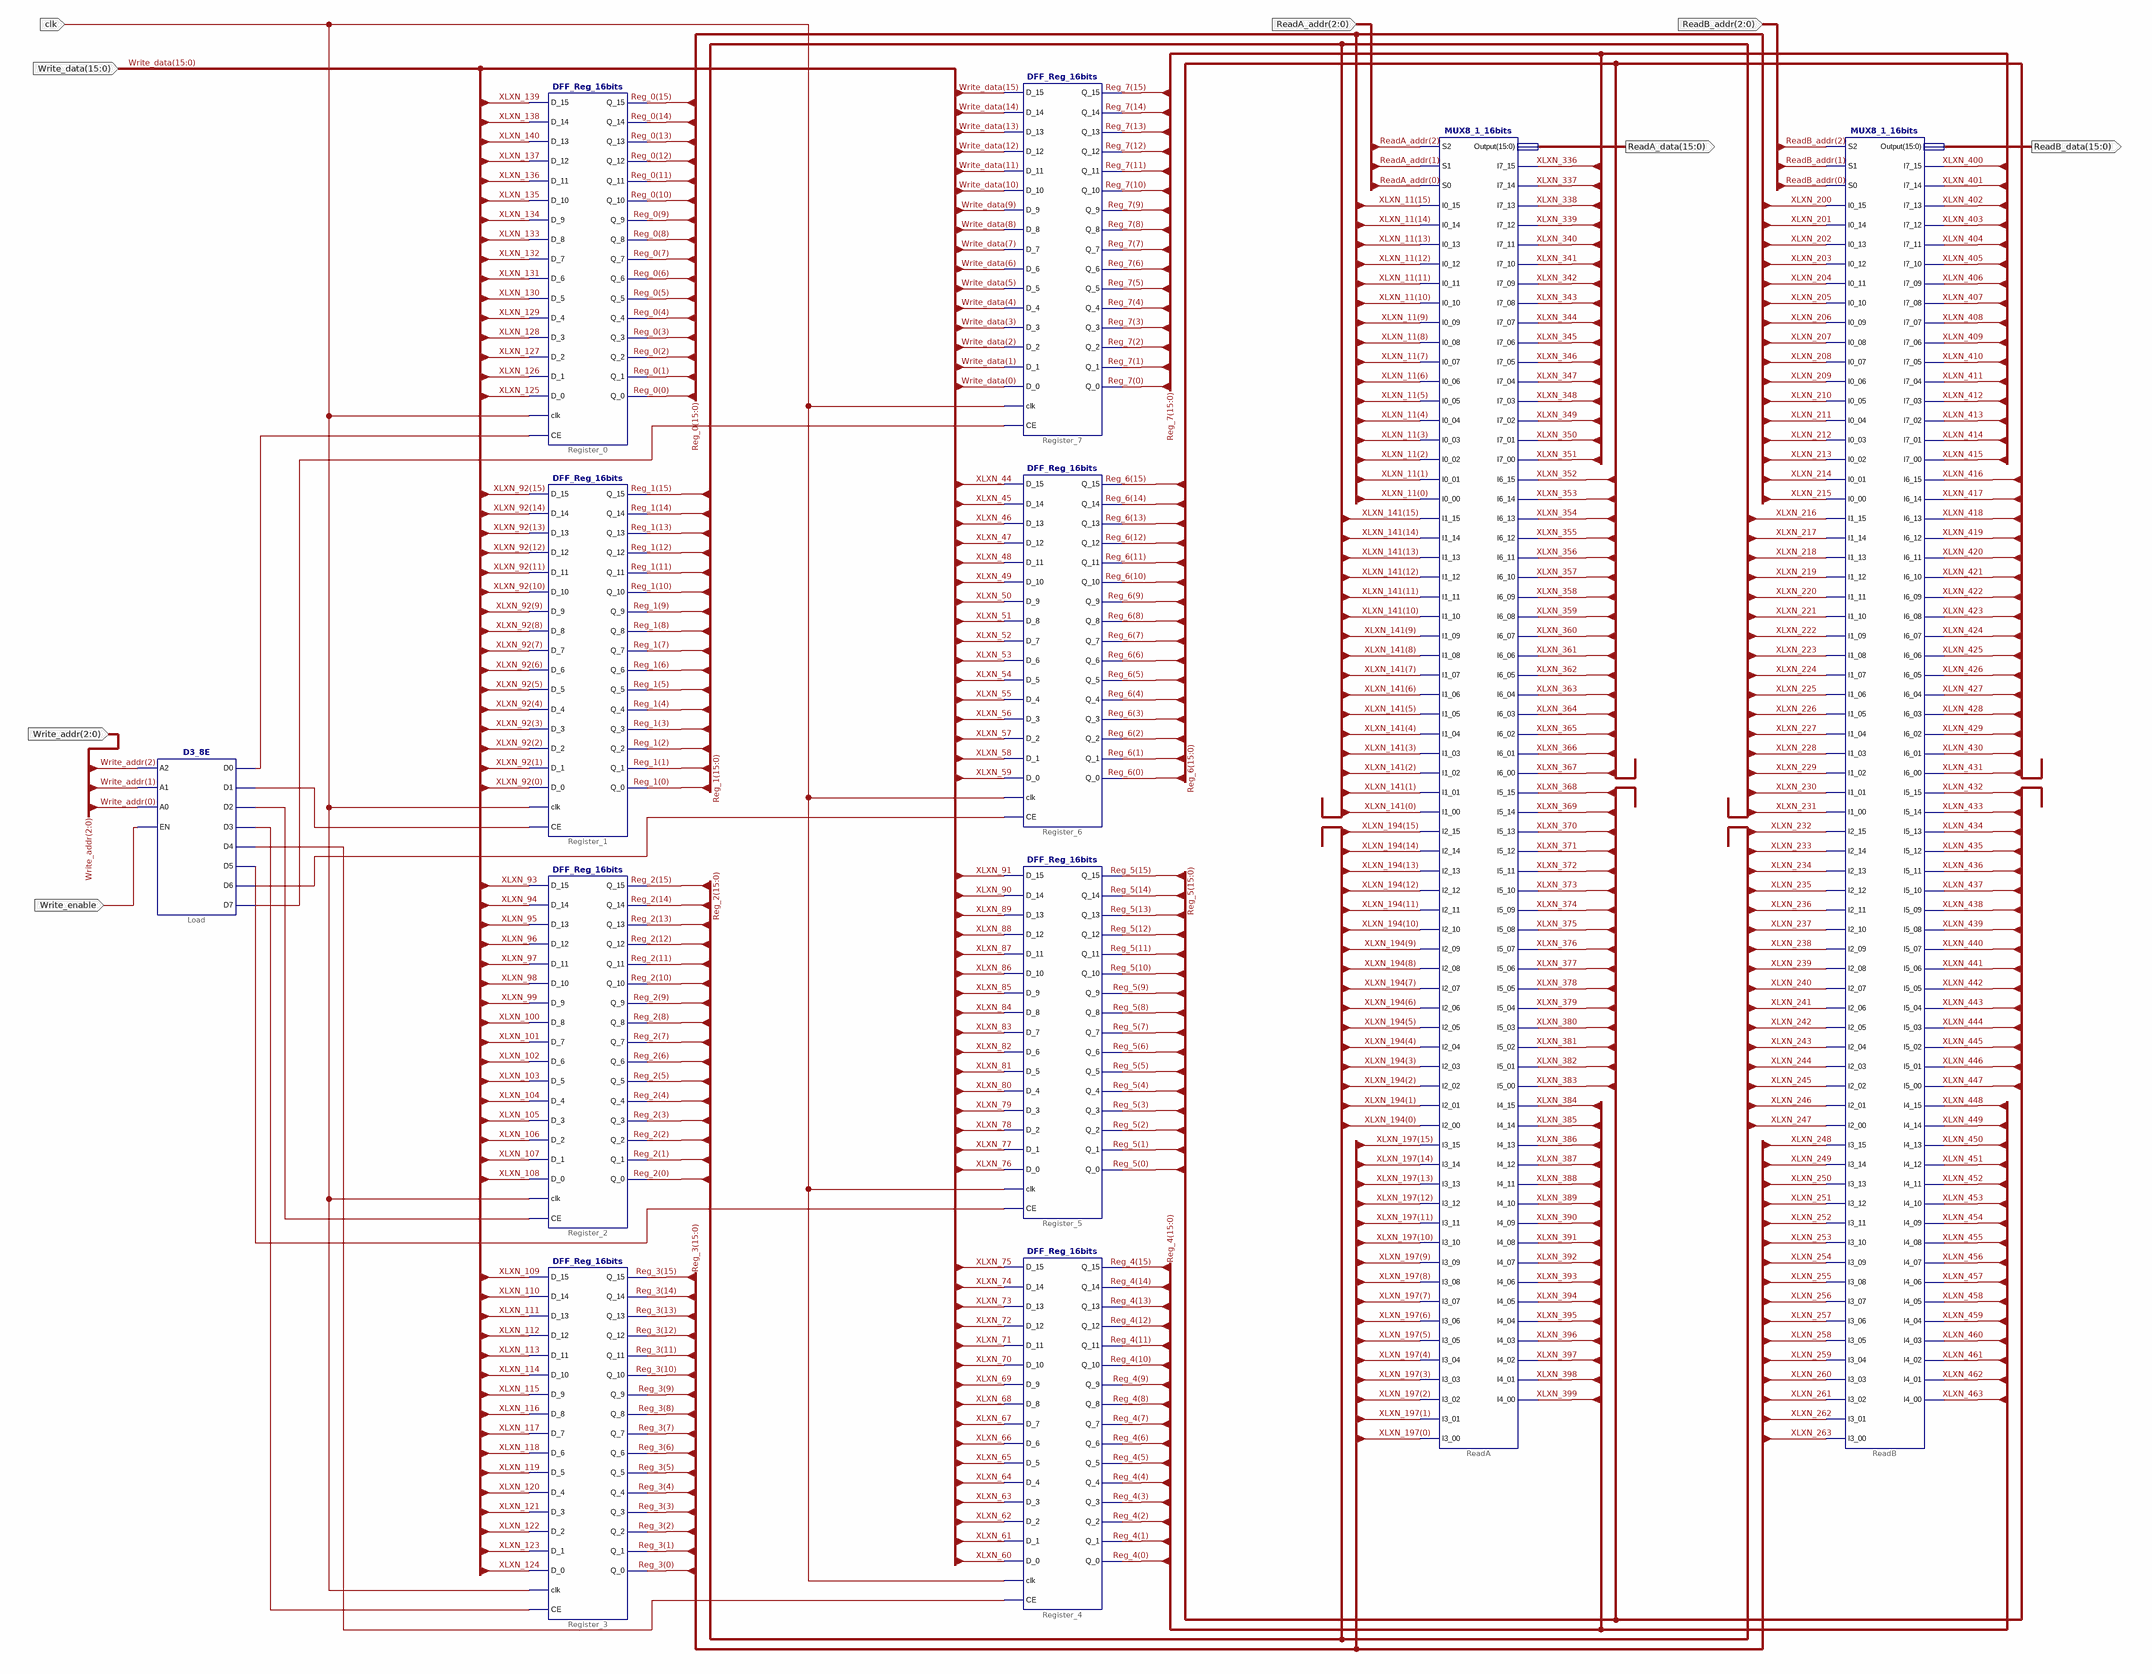
[diagram p0: schematic sheet 1]
// Xilinx ISE schematic Reg_File_16bits.sch (virtex6) as structural Verilog: 11 symbols, 8 ports
module Reg_File_16bits (
  input  [2:0] Write_addr,
  input  Write_enable,
  input  clk,
  input  [15:0] Write_data,
  input  [2:0] ReadA_addr,
  input  [2:0] ReadB_addr,
  output [15:0] ReadA_data,
  output [15:0] ReadB_data
);

  wire XLXN_1, XLXN_2, XLXN_8, XLXN_9, XLXN_44, XLXN_45, XLXN_46, XLXN_47, XLXN_48, XLXN_49, XLXN_50,
       XLXN_51, XLXN_52, XLXN_53, XLXN_54, XLXN_55, XLXN_56, XLXN_57, XLXN_58, XLXN_59, XLXN_60, XLXN_61,
       XLXN_62, XLXN_63, XLXN_64, XLXN_65, XLXN_66, XLXN_67, XLXN_68, XLXN_69, XLXN_70, XLXN_71, XLXN_72,
       XLXN_73, XLXN_74, XLXN_75, XLXN_76, XLXN_77, XLXN_78, XLXN_79, XLXN_80, XLXN_81, XLXN_82, XLXN_83,
       XLXN_84, XLXN_85, XLXN_86, XLXN_87, XLXN_88, XLXN_89, XLXN_90, XLXN_91, XLXN_93, XLXN_94, XLXN_95,
       XLXN_96, XLXN_97, XLXN_98, XLXN_99, XLXN_100, XLXN_101, XLXN_102, XLXN_103, XLXN_104, XLXN_105,
       XLXN_106, XLXN_107, XLXN_108, XLXN_109, XLXN_110, XLXN_111, XLXN_112, XLXN_113, XLXN_114, XLXN_115,
       XLXN_116, XLXN_117, XLXN_118, XLXN_119, XLXN_120, XLXN_121, XLXN_122, XLXN_123, XLXN_124, XLXN_125,
       XLXN_126, XLXN_127, XLXN_128, XLXN_129, XLXN_130, XLXN_131, XLXN_132, XLXN_133, XLXN_134, XLXN_135,
       XLXN_136, XLXN_137, XLXN_138, XLXN_139, XLXN_140, XLXN_200, XLXN_201, XLXN_202, XLXN_203, XLXN_204,
       XLXN_205, XLXN_206, XLXN_207, XLXN_208, XLXN_209, XLXN_210, XLXN_211, XLXN_212, XLXN_213, XLXN_214,
       XLXN_215, XLXN_216, XLXN_217, XLXN_218, XLXN_219, XLXN_220, XLXN_221, XLXN_222, XLXN_223, XLXN_224,
       XLXN_225, XLXN_226, XLXN_227, XLXN_228, XLXN_229, XLXN_230, XLXN_231, XLXN_232, XLXN_233, XLXN_234,
       XLXN_235, XLXN_236, XLXN_237, XLXN_238, XLXN_239, XLXN_240, XLXN_241, XLXN_242, XLXN_243, XLXN_244,
       XLXN_245, XLXN_246, XLXN_247, XLXN_248, XLXN_249, XLXN_250, XLXN_251, XLXN_252, XLXN_253, XLXN_254,
       XLXN_255, XLXN_256, XLXN_257, XLXN_258, XLXN_259, XLXN_260, XLXN_261, XLXN_262, XLXN_263, XLXN_336,
       XLXN_337, XLXN_338, XLXN_339, XLXN_340, XLXN_341, XLXN_342, XLXN_343, XLXN_344, XLXN_345, XLXN_346,
       XLXN_347, XLXN_348, XLXN_349, XLXN_350, XLXN_351, XLXN_352, XLXN_353, XLXN_354, XLXN_355, XLXN_356,
       XLXN_357, XLXN_358, XLXN_359, XLXN_360, XLXN_361, XLXN_362, XLXN_363, XLXN_364, XLXN_365, XLXN_366,
       XLXN_367, XLXN_368, XLXN_369, XLXN_370, XLXN_371, XLXN_372, XLXN_373, XLXN_374, XLXN_375, XLXN_376,
       XLXN_377, XLXN_378, XLXN_379, XLXN_380, XLXN_381, XLXN_382, XLXN_383, XLXN_384, XLXN_385, XLXN_386,
       XLXN_387, XLXN_388, XLXN_389, XLXN_390, XLXN_391, XLXN_392, XLXN_393, XLXN_394, XLXN_395, XLXN_396,
       XLXN_397, XLXN_398, XLXN_399, XLXN_400, XLXN_401, XLXN_402, XLXN_403, XLXN_404, XLXN_405, XLXN_406,
       XLXN_407, XLXN_408, XLXN_409, XLXN_410, XLXN_411, XLXN_412, XLXN_413, XLXN_414, XLXN_415, XLXN_416,
       XLXN_417, XLXN_418, XLXN_419, XLXN_420, XLXN_421, XLXN_422, XLXN_423, XLXN_424, XLXN_425, XLXN_426,
       XLXN_427, XLXN_428, XLXN_429, XLXN_430, XLXN_431, XLXN_432, XLXN_433, XLXN_434, XLXN_435, XLXN_436,
       XLXN_437, XLXN_438, XLXN_439, XLXN_440, XLXN_441, XLXN_442, XLXN_443, XLXN_444, XLXN_445, XLXN_446,
       XLXN_447, XLXN_448, XLXN_449, XLXN_450, XLXN_451, XLXN_452, XLXN_453, XLXN_454, XLXN_455, XLXN_456,
       XLXN_457, XLXN_458, XLXN_459, XLXN_460, XLXN_461, XLXN_462, XLXN_463, XLXN_756, XLXN_757, XLXN_758,
       XLXN_759;
  wire [15:0] Reg_0, Reg_1, Reg_2, Reg_3, Reg_4, Reg_5, Reg_6, Reg_7, XLXN_11, XLXN_92, XLXN_141, XLXN_194,
       XLXN_197;

  DFF_Reg_16bits Register_0 (
    .CE(XLXN_1), .clk(clk), .D_0(XLXN_125), .D_1(XLXN_126), .D_10(XLXN_135), .D_11(XLXN_136),
    .D_12(XLXN_137), .D_13(XLXN_140), .D_14(XLXN_138), .D_15(XLXN_139), .D_2(XLXN_127), .D_3(XLXN_128),
    .D_4(XLXN_129), .D_5(XLXN_130), .D_6(XLXN_131), .D_7(XLXN_132), .D_8(XLXN_133), .D_9(XLXN_134),
    .Q_0(Reg_0[0]), .Q_1(Reg_0[1]), .Q_10(Reg_0[10]), .Q_11(Reg_0[11]), .Q_12(Reg_0[12]), .Q_13(Reg_0[13]),
    .Q_14(Reg_0[14]), .Q_15(Reg_0[15]), .Q_2(Reg_0[2]), .Q_3(Reg_0[3]), .Q_4(Reg_0[4]), .Q_5(Reg_0[5]),
    .Q_6(Reg_0[6]), .Q_7(Reg_0[7]), .Q_8(Reg_0[8]), .Q_9(Reg_0[9]));
  DFF_Reg_16bits Register_1 (
    .CE(XLXN_2), .clk(clk), .D_0(XLXN_92[0]), .D_1(XLXN_92[1]), .D_10(XLXN_92[10]), .D_11(XLXN_92[11]),
    .D_12(XLXN_92[12]), .D_13(XLXN_92[13]), .D_14(XLXN_92[14]), .D_15(XLXN_92[15]), .D_2(XLXN_92[2]),
    .D_3(XLXN_92[3]), .D_4(XLXN_92[4]), .D_5(XLXN_92[5]), .D_6(XLXN_92[6]), .D_7(XLXN_92[7]),
    .D_8(XLXN_92[8]), .D_9(XLXN_92[9]), .Q_0(Reg_1[0]), .Q_1(Reg_1[1]), .Q_10(Reg_1[10]), .Q_11(Reg_1[11]),
    .Q_12(Reg_1[12]), .Q_13(Reg_1[13]), .Q_14(Reg_1[14]), .Q_15(Reg_1[15]), .Q_2(Reg_1[2]), .Q_3(Reg_1[3]),
    .Q_4(Reg_1[4]), .Q_5(Reg_1[5]), .Q_6(Reg_1[6]), .Q_7(Reg_1[7]), .Q_8(Reg_1[8]), .Q_9(Reg_1[9]));
  DFF_Reg_16bits Register_2 (
    .CE(XLXN_8), .clk(clk), .D_0(XLXN_108), .D_1(XLXN_107), .D_10(XLXN_98), .D_11(XLXN_97), .D_12(XLXN_96),
    .D_13(XLXN_95), .D_14(XLXN_94), .D_15(XLXN_93), .D_2(XLXN_106), .D_3(XLXN_105), .D_4(XLXN_104),
    .D_5(XLXN_103), .D_6(XLXN_102), .D_7(XLXN_101), .D_8(XLXN_100), .D_9(XLXN_99), .Q_0(Reg_2[0]),
    .Q_1(Reg_2[1]), .Q_10(Reg_2[10]), .Q_11(Reg_2[11]), .Q_12(Reg_2[12]), .Q_13(Reg_2[13]), .Q_14(Reg_2[14]),
    .Q_15(Reg_2[15]), .Q_2(Reg_2[2]), .Q_3(Reg_2[3]), .Q_4(Reg_2[4]), .Q_5(Reg_2[5]), .Q_6(Reg_2[6]),
    .Q_7(Reg_2[7]), .Q_8(Reg_2[8]), .Q_9(Reg_2[9]));
  DFF_Reg_16bits Register_3 (
    .CE(XLXN_9), .clk(clk), .D_0(XLXN_124), .D_1(XLXN_123), .D_10(XLXN_114), .D_11(XLXN_113),
    .D_12(XLXN_112), .D_13(XLXN_111), .D_14(XLXN_110), .D_15(XLXN_109), .D_2(XLXN_122), .D_3(XLXN_121),
    .D_4(XLXN_120), .D_5(XLXN_119), .D_6(XLXN_118), .D_7(XLXN_117), .D_8(XLXN_116), .D_9(XLXN_115),
    .Q_0(Reg_3[0]), .Q_1(Reg_3[1]), .Q_10(Reg_3[10]), .Q_11(Reg_3[11]), .Q_12(Reg_3[12]), .Q_13(Reg_3[13]),
    .Q_14(Reg_3[14]), .Q_15(Reg_3[15]), .Q_2(Reg_3[2]), .Q_3(Reg_3[3]), .Q_4(Reg_3[4]), .Q_5(Reg_3[5]),
    .Q_6(Reg_3[6]), .Q_7(Reg_3[7]), .Q_8(Reg_3[8]), .Q_9(Reg_3[9]));
  DFF_Reg_16bits Register_7 (
    .CE(XLXN_756), .clk(clk), .D_0(Write_data[0]), .D_1(Write_data[1]), .D_10(Write_data[10]),
    .D_11(Write_data[11]), .D_12(Write_data[12]), .D_13(Write_data[13]), .D_14(Write_data[14]),
    .D_15(Write_data[15]), .D_2(Write_data[2]), .D_3(Write_data[3]), .D_4(Write_data[4]),
    .D_5(Write_data[5]), .D_6(Write_data[6]), .D_7(Write_data[7]), .D_8(Write_data[8]), .D_9(Write_data[9]),
    .Q_0(Reg_7[0]), .Q_1(Reg_7[1]), .Q_10(Reg_7[10]), .Q_11(Reg_7[11]), .Q_12(Reg_7[12]), .Q_13(Reg_7[13]),
    .Q_14(Reg_7[14]), .Q_15(Reg_7[15]), .Q_2(Reg_7[2]), .Q_3(Reg_7[3]), .Q_4(Reg_7[4]), .Q_5(Reg_7[5]),
    .Q_6(Reg_7[6]), .Q_7(Reg_7[7]), .Q_8(Reg_7[8]), .Q_9(Reg_7[9]));
  DFF_Reg_16bits Register_6 (
    .CE(XLXN_757), .clk(clk), .D_0(XLXN_59), .D_1(XLXN_58), .D_10(XLXN_49), .D_11(XLXN_48), .D_12(XLXN_47),
    .D_13(XLXN_46), .D_14(XLXN_45), .D_15(XLXN_44), .D_2(XLXN_57), .D_3(XLXN_56), .D_4(XLXN_55),
    .D_5(XLXN_54), .D_6(XLXN_53), .D_7(XLXN_52), .D_8(XLXN_51), .D_9(XLXN_50), .Q_0(Reg_6[0]),
    .Q_1(Reg_6[1]), .Q_10(Reg_6[10]), .Q_11(Reg_6[11]), .Q_12(Reg_6[12]), .Q_13(Reg_6[13]), .Q_14(Reg_6[14]),
    .Q_15(Reg_6[15]), .Q_2(Reg_6[2]), .Q_3(Reg_6[3]), .Q_4(Reg_6[4]), .Q_5(Reg_6[5]), .Q_6(Reg_6[6]),
    .Q_7(Reg_6[7]), .Q_8(Reg_6[8]), .Q_9(Reg_6[9]));
  MUX8_1_16bits ReadB (
    .I4_00(XLXN_463), .I4_01(XLXN_462), .I4_02(XLXN_461), .I4_03(XLXN_460), .I4_04(XLXN_459),
    .I4_05(XLXN_458), .I4_06(XLXN_457), .I4_07(XLXN_456), .I4_08(XLXN_455), .I4_09(XLXN_454),
    .I4_10(XLXN_453), .I4_11(XLXN_452), .I4_12(XLXN_451), .I4_13(XLXN_450), .I4_14(XLXN_449),
    .I4_15(XLXN_448), .I5_00(XLXN_447), .I5_01(XLXN_446), .I5_02(XLXN_445), .I5_03(XLXN_444),
    .I5_04(XLXN_443), .I5_05(XLXN_442), .I5_06(XLXN_441), .I5_07(XLXN_440), .I5_08(XLXN_439),
    .I5_09(XLXN_438), .I5_10(XLXN_437), .I5_11(XLXN_436), .I5_12(XLXN_435), .I5_13(XLXN_434),
    .I5_14(XLXN_433), .I5_15(XLXN_432), .I6_00(XLXN_431), .I6_01(XLXN_430), .I6_02(XLXN_429),
    .I6_03(XLXN_428), .I6_04(XLXN_427), .I6_05(XLXN_426), .I6_06(XLXN_425), .I6_07(XLXN_424),
    .I6_08(XLXN_423), .I6_09(XLXN_422), .I6_10(XLXN_421), .I6_11(XLXN_420), .I6_12(XLXN_419),
    .I6_13(XLXN_418), .I6_14(XLXN_417), .I6_15(XLXN_416), .I7_00(XLXN_415), .I7_01(XLXN_414),
    .I7_02(XLXN_413), .I7_03(XLXN_412), .I7_04(XLXN_411), .I7_05(XLXN_410), .I7_06(XLXN_409),
    .I7_07(XLXN_408), .I7_08(XLXN_407), .I7_09(XLXN_406), .I7_10(XLXN_405), .I7_11(XLXN_404),
    .I7_12(XLXN_403), .I7_13(XLXN_402), .I7_14(XLXN_401), .I7_15(XLXN_400), .Output(ReadB_data),
    .S2(ReadB_addr[2]), .S1(ReadB_addr[1]), .S0(ReadB_addr[0]), .I3_15(XLXN_248), .I3_14(XLXN_249),
    .I3_13(XLXN_250), .I3_12(XLXN_251), .I3_11(XLXN_252), .I3_10(XLXN_253), .I3_09(XLXN_254),
    .I3_08(XLXN_255), .I3_07(XLXN_256), .I3_06(XLXN_257), .I3_05(XLXN_258), .I3_04(XLXN_259),
    .I3_03(XLXN_260), .I3_02(XLXN_261), .I3_01(XLXN_262), .I3_00(XLXN_263), .I2_15(XLXN_232),
    .I2_14(XLXN_233), .I2_13(XLXN_234), .I2_12(XLXN_235), .I2_11(XLXN_236), .I2_10(XLXN_237),
    .I2_09(XLXN_238), .I2_08(XLXN_239), .I2_07(XLXN_240), .I2_06(XLXN_241), .I2_05(XLXN_242),
    .I2_04(XLXN_243), .I2_03(XLXN_244), .I2_02(XLXN_245), .I2_01(XLXN_246), .I2_00(XLXN_247),
    .I1_15(XLXN_216), .I1_14(XLXN_217), .I1_13(XLXN_218), .I1_12(XLXN_219), .I1_11(XLXN_220),
    .I1_10(XLXN_221), .I1_09(XLXN_222), .I1_08(XLXN_223), .I1_07(XLXN_224), .I1_06(XLXN_225),
    .I1_05(XLXN_226), .I1_04(XLXN_227), .I1_03(XLXN_228), .I1_02(XLXN_229), .I1_01(XLXN_230),
    .I1_00(XLXN_231), .I0_15(XLXN_200), .I0_14(XLXN_201), .I0_13(XLXN_202), .I0_12(XLXN_203),
    .I0_11(XLXN_204), .I0_10(XLXN_205), .I0_09(XLXN_206), .I0_08(XLXN_207), .I0_07(XLXN_208),
    .I0_06(XLXN_209), .I0_05(XLXN_210), .I0_04(XLXN_211), .I0_03(XLXN_212), .I0_02(XLXN_213),
    .I0_01(XLXN_214), .I0_00(XLXN_215));
  DFF_Reg_16bits Register_5 (
    .CE(XLXN_758), .clk(clk), .D_0(XLXN_76), .D_1(XLXN_77), .D_10(XLXN_86), .D_11(XLXN_87), .D_12(XLXN_88),
    .D_13(XLXN_89), .D_14(XLXN_90), .D_15(XLXN_91), .D_2(XLXN_78), .D_3(XLXN_79), .D_4(XLXN_80),
    .D_5(XLXN_81), .D_6(XLXN_82), .D_7(XLXN_83), .D_8(XLXN_84), .D_9(XLXN_85), .Q_0(Reg_5[0]),
    .Q_1(Reg_5[1]), .Q_10(Reg_5[10]), .Q_11(Reg_5[11]), .Q_12(Reg_5[12]), .Q_13(Reg_5[13]), .Q_14(Reg_5[14]),
    .Q_15(Reg_5[15]), .Q_2(Reg_5[2]), .Q_3(Reg_5[3]), .Q_4(Reg_5[4]), .Q_5(Reg_5[5]), .Q_6(Reg_5[6]),
    .Q_7(Reg_5[7]), .Q_8(Reg_5[8]), .Q_9(Reg_5[9]));
  DFF_Reg_16bits Register_4 (
    .CE(XLXN_759), .clk(clk), .D_0(XLXN_60), .D_1(XLXN_61), .D_10(XLXN_70), .D_11(XLXN_71), .D_12(XLXN_72),
    .D_13(XLXN_73), .D_14(XLXN_74), .D_15(XLXN_75), .D_2(XLXN_62), .D_3(XLXN_63), .D_4(XLXN_64),
    .D_5(XLXN_65), .D_6(XLXN_66), .D_7(XLXN_67), .D_8(XLXN_68), .D_9(XLXN_69), .Q_0(Reg_4[0]),
    .Q_1(Reg_4[1]), .Q_10(Reg_4[10]), .Q_11(Reg_4[11]), .Q_12(Reg_4[12]), .Q_13(Reg_4[13]), .Q_14(Reg_4[14]),
    .Q_15(Reg_4[15]), .Q_2(Reg_4[2]), .Q_3(Reg_4[3]), .Q_4(Reg_4[4]), .Q_5(Reg_4[5]), .Q_6(Reg_4[6]),
    .Q_7(Reg_4[7]), .Q_8(Reg_4[8]), .Q_9(Reg_4[9]));
  D3_8E Load (
    .A0(Write_addr[0]), .A1(Write_addr[1]), .A2(Write_addr[2]), .D0(XLXN_1), .D1(XLXN_2), .D2(XLXN_8),
    .D3(XLXN_9), .D4(XLXN_759), .D5(XLXN_758), .D6(XLXN_757), .D7(XLXN_756), .EN(Write_enable));
  MUX8_1_16bits ReadA (
    .I4_00(XLXN_399), .I4_01(XLXN_398), .I4_02(XLXN_397), .I4_03(XLXN_396), .I4_04(XLXN_395),
    .I4_05(XLXN_394), .I4_06(XLXN_393), .I4_07(XLXN_392), .I4_08(XLXN_391), .I4_09(XLXN_390),
    .I4_10(XLXN_389), .I4_11(XLXN_388), .I4_12(XLXN_387), .I4_13(XLXN_386), .I4_14(XLXN_385),
    .I4_15(XLXN_384), .I5_00(XLXN_383), .I5_01(XLXN_382), .I5_02(XLXN_381), .I5_03(XLXN_380),
    .I5_04(XLXN_379), .I5_05(XLXN_378), .I5_06(XLXN_377), .I5_07(XLXN_376), .I5_08(XLXN_375),
    .I5_09(XLXN_374), .I5_10(XLXN_373), .I5_11(XLXN_372), .I5_12(XLXN_371), .I5_13(XLXN_370),
    .I5_14(XLXN_369), .I5_15(XLXN_368), .I6_00(XLXN_367), .I6_01(XLXN_366), .I6_02(XLXN_365),
    .I6_03(XLXN_364), .I6_04(XLXN_363), .I6_05(XLXN_362), .I6_06(XLXN_361), .I6_07(XLXN_360),
    .I6_08(XLXN_359), .I6_09(XLXN_358), .I6_10(XLXN_357), .I6_11(XLXN_356), .I6_12(XLXN_355),
    .I6_13(XLXN_354), .I6_14(XLXN_353), .I6_15(XLXN_352), .I7_00(XLXN_351), .I7_01(XLXN_350),
    .I7_02(XLXN_349), .I7_03(XLXN_348), .I7_04(XLXN_347), .I7_05(XLXN_346), .I7_06(XLXN_345),
    .I7_07(XLXN_344), .I7_08(XLXN_343), .I7_09(XLXN_342), .I7_10(XLXN_341), .I7_11(XLXN_340),
    .I7_12(XLXN_339), .I7_13(XLXN_338), .I7_14(XLXN_337), .I7_15(XLXN_336), .Output(ReadA_data),
    .S2(ReadA_addr[2]), .S1(ReadA_addr[1]), .S0(ReadA_addr[0]), .I3_15(XLXN_197[15]), .I3_14(XLXN_197[14]),
    .I3_13(XLXN_197[13]), .I3_12(XLXN_197[12]), .I3_11(XLXN_197[11]), .I3_10(XLXN_197[10]),
    .I3_09(XLXN_197[9]), .I3_08(XLXN_197[8]), .I3_07(XLXN_197[7]), .I3_06(XLXN_197[6]), .I3_05(XLXN_197[5]),
    .I3_04(XLXN_197[4]), .I3_03(XLXN_197[3]), .I3_02(XLXN_197[2]), .I3_01(XLXN_197[1]), .I3_00(XLXN_197[0]),
    .I2_15(XLXN_194[15]), .I2_14(XLXN_194[14]), .I2_13(XLXN_194[13]), .I2_12(XLXN_194[12]),
    .I2_11(XLXN_194[11]), .I2_10(XLXN_194[10]), .I2_09(XLXN_194[9]), .I2_08(XLXN_194[8]),
    .I2_07(XLXN_194[7]), .I2_06(XLXN_194[6]), .I2_05(XLXN_194[5]), .I2_04(XLXN_194[4]), .I2_03(XLXN_194[3]),
    .I2_02(XLXN_194[2]), .I2_01(XLXN_194[1]), .I2_00(XLXN_194[0]), .I1_15(XLXN_141[15]),
    .I1_14(XLXN_141[14]), .I1_13(XLXN_141[13]), .I1_12(XLXN_141[12]), .I1_11(XLXN_141[11]),
    .I1_10(XLXN_141[10]), .I1_09(XLXN_141[9]), .I1_08(XLXN_141[8]), .I1_07(XLXN_141[7]), .I1_06(XLXN_141[6]),
    .I1_05(XLXN_141[5]), .I1_04(XLXN_141[4]), .I1_03(XLXN_141[3]), .I1_02(XLXN_141[2]), .I1_01(XLXN_141[1]),
    .I1_00(XLXN_141[0]), .I0_15(XLXN_11[15]), .I0_14(XLXN_11[14]), .I0_13(XLXN_11[13]), .I0_12(XLXN_11[12]),
    .I0_11(XLXN_11[11]), .I0_10(XLXN_11[10]), .I0_09(XLXN_11[9]), .I0_08(XLXN_11[8]), .I0_07(XLXN_11[7]),
    .I0_06(XLXN_11[6]), .I0_05(XLXN_11[5]), .I0_04(XLXN_11[4]), .I0_03(XLXN_11[3]), .I0_02(XLXN_11[2]),
    .I0_01(XLXN_11[1]), .I0_00(XLXN_11[0]));
endmodule
